# EAGLE design AudioTest (EAGLE 7.7.0)
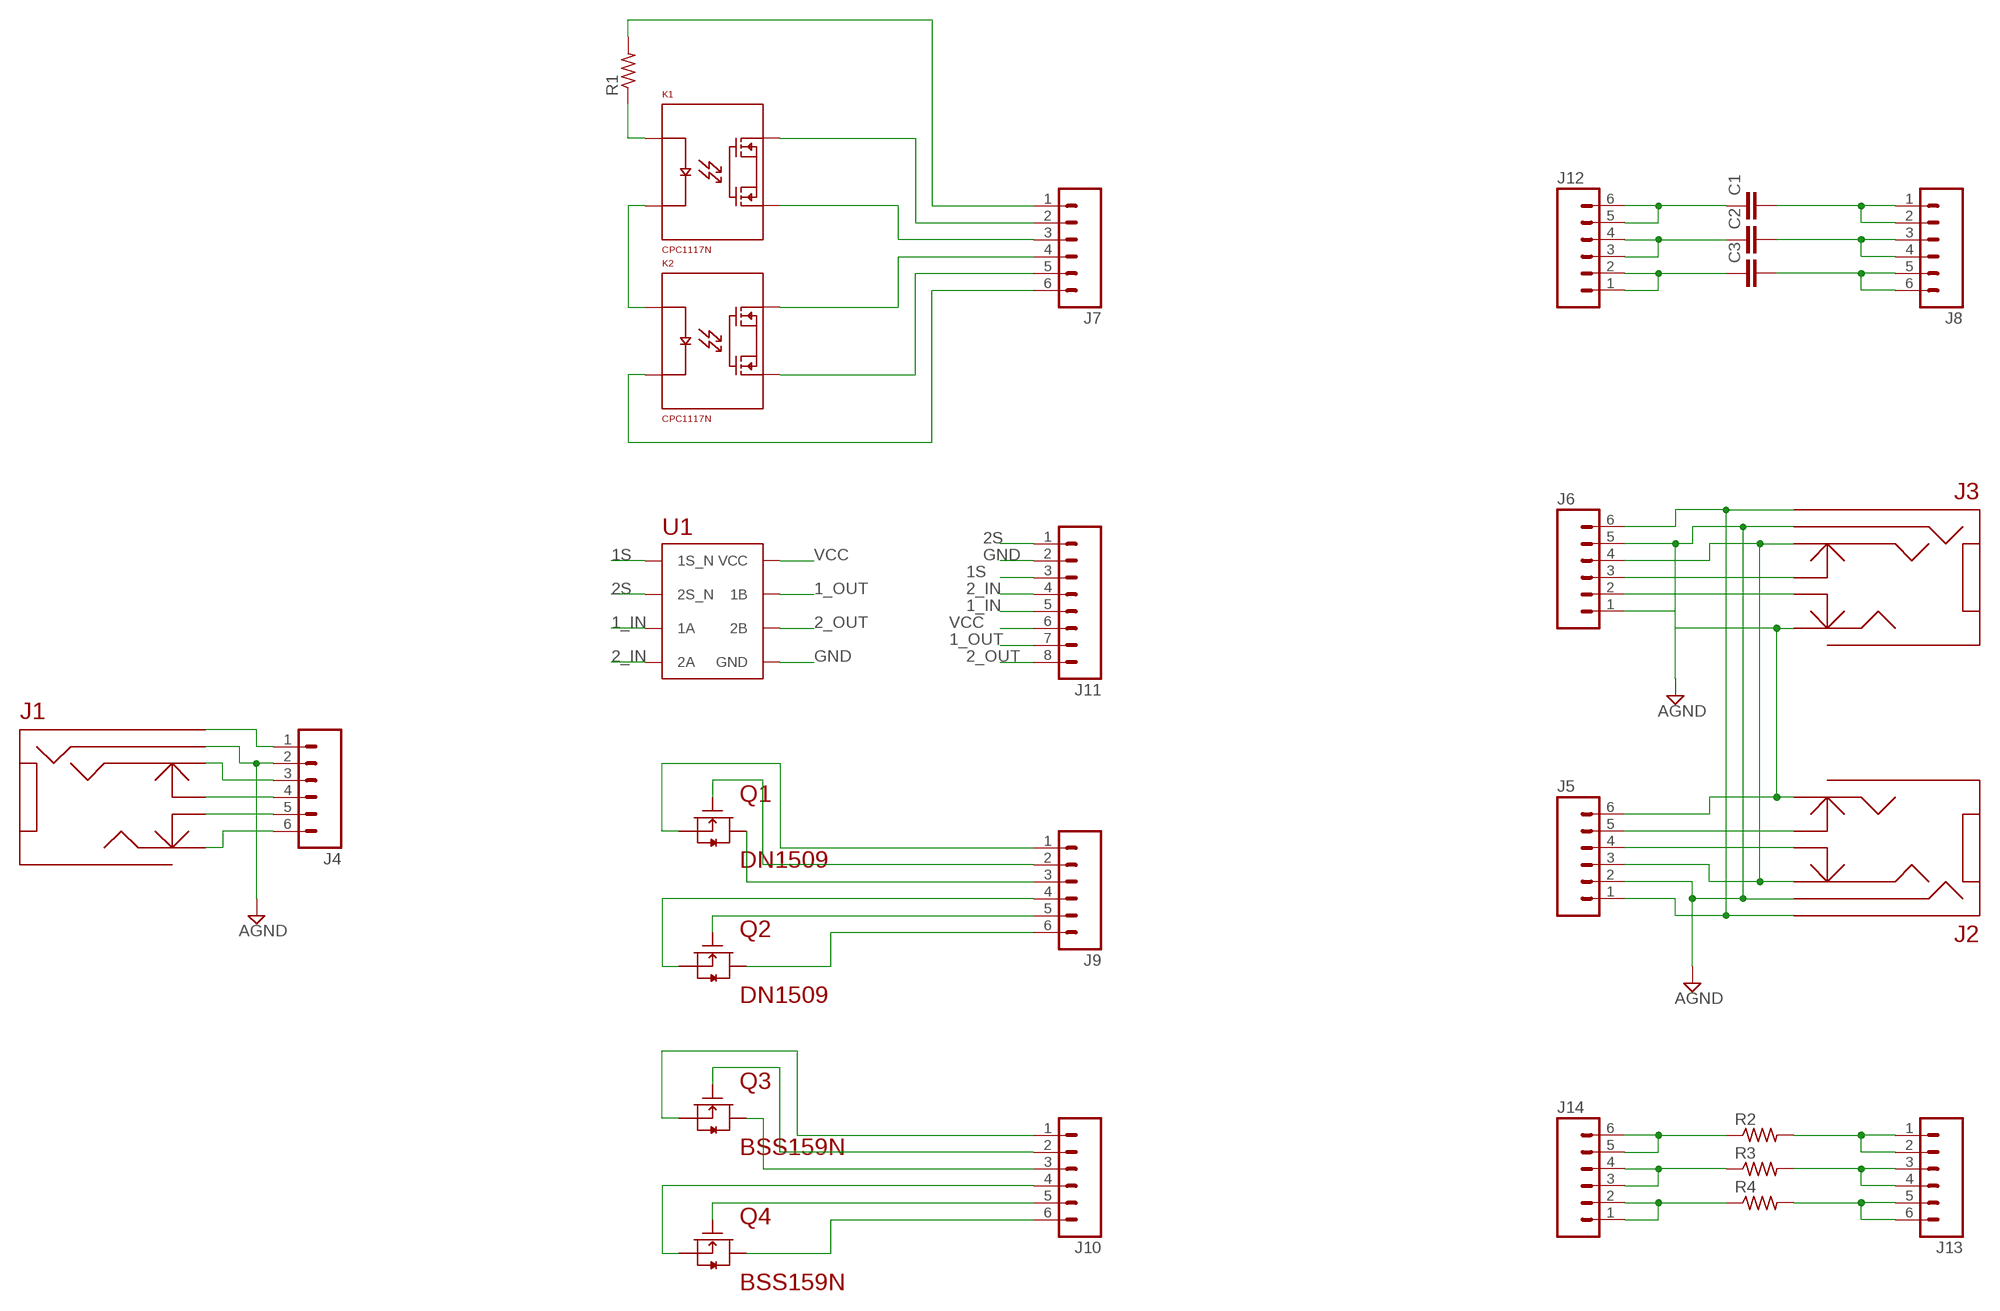
[diagram p0: schematic, sheet 1]

## Parts
C1  C-EUC1210  [C1210]
C2  C-EUC1210  [C1210]
C3  C-EUC1210  [C1210]
J1  SJ-43516  [SJ-43516-SMT]
J2  SJ-43516  [SJ-43516-SMT]
J3  SJ-43516  [SJ-43516-SMT]
J4  M06LOCK  [1X06_LOCK]
J5  M06LOCK  [1X06_LOCK]
J6  M06LOCK  [1X06_LOCK]
J7  M06LOCK  [1X06_LOCK]
J8  M06LOCK  [1X06_LOCK]
J9  M06LOCK  [1X06_LOCK]
J10  M06LOCK  [1X06_LOCK]
J11  M08LOCK  [1X08_LOCK]
J12  M06LOCK  [1X06_LOCK]
J13  M06LOCK  [1X06_LOCK]
J14  M06LOCK  [1X06_LOCK]
K1  CPC1117N  [4-SOP]
K2  CPC1117N  [4-SOP]
Q1  DN1509  [SOT-23-5]
Q2  DN1509  [SOT-23-5]
Q3  BSS159N  [SOT-23-3]
Q4  BSS159N  [SOT-23-3]
R1  R-US_R0805  [R0805]
R2  R-US_M0805  [M0805]
R3  R-US_M0805  [M0805]
R4  R-US_M0805  [M0805]
U1  FSA553  [9-UFBGA-NSMD]

## Nets
1_IN: J11.5 U1.A1(1A)
1_L: J1.2(LEFT) J4.6
1_L_SW: J1.5(LEFT_NC) J4.5
1_M: J1.1(MIC) J4.1
1_OUT: J11.7 U1.A3(1B)
1_R: J1.3(RIGHT) J4.3
1_R_SW: J1.6(RIGHT_NC) J4.4
1S: J11.3 U1.C1(1S_N)
2_IN: J11.4 U1.B1(2A)
2_L: J2.2(LEFT) J3.2(LEFT) J5.6 J6.1
2_L_SW: J2.5(LEFT_NC) J5.5
2_M: J2.1(MIC) J3.1(MIC) J5.1 J6.6
2_OUT: J11.8 U1.B3(2B)
2_R: J2.3(RIGHT) J3.3(RIGHT) J5.3 J6.4
2_R_SW: J2.6(RIGHT_NC) J5.4
2S: J11.1 U1.C3(2S_N)
3_SW_L: J3.5(LEFT_NC) J6.2
3_SW_R: J3.6(RIGHT_NC) J6.3
AGND: J1.4(GND) J2.4(GND) J3.4(GND) J4.2 J5.2 J6.5
D1: J9.3 Q1.2(D)
D2: J9.6 Q2.2(D)
D3: J10.3 Q3.3(D)
D4: J10.6 Q4.3(D)
G1: J9.2 Q1.5(G)
G2: J9.5 Q2.5(G)
G3: J10.2 Q3.1(G)
G4: J10.5 Q4.1(G)
GND: J11.2 U1.C2(GND)
N$3: C3.1 J12.1 J12.2
N$10: C3.2 J8.5 J8.6
N$15: K1.1(A) R1.1
N$16: K1.2(C) K2.1(A)
N$34: C2.2 J8.3 J8.4
N$35: C1.2 J8.1 J8.2
N$36: C1.1 J12.5 J12.6
N$37: C2.1 J12.3 J12.4
N$38: J14.1 J14.2 R4.1
N$39: J13.5 J13.6 R4.2
N$40: J13.3 J13.4 R3.2
N$41: J13.1 J13.2 R2.2
N$42: J14.5 J14.6 R2.1
N$43: J14.3 J14.4 R3.1
R_GND: J7.6 K2.2(C)
R_IN1: J7.2 K1.4(LOAD1)
R_IN2: J7.4 K2.4(LOAD1)
R_OUT1: J7.3 K1.3(LOAD2)
R_OUT2: J7.5 K2.3(LOAD2)
R_V+: J7.1 R1.2
S1: J9.1 Q1.4(S)
S2: J9.4 Q2.4(S)
S3: J10.1 Q3.2(S)
S4: J10.4 Q4.2(S)
VCC: J11.6 U1.A2(VCC)

## Library data of the parts
C1-C3 = resistor:C-EU: CAPACITOR, European symbol
J1-J3 = Master:SJ-43516: SJ-43516 - Female 3.5mm Audio Connector Datasheet: http://www.cui.com/product/resource/sj-4351x-smt-series.pdf
J4-J10 J12-J14 = SparkFun-Connectors:M06: Header 6 Standard 6-pin 0.1" header. Use with straight break away headers (SKU : PRT-00116), right angle break away headers (PRT-00553), swiss pins (PRT-00743), machine pins (PRT-00117), and female headers (PRT-00115). Molex polarized connector foot print use with SKU : PRT-08094 with associated crimp pins and housings. NOTES ON THE VARIANTS LOCK and LOCK_LONGPADS... This footprint was designed to help hold the alignment of a through-hole component (i.e. 6-pin header) while soldering it into place. You may notice that each hole has been shifted either up or down by 0.005 of an inch from it's more standard position (which is a perfectly straight line). This slight alteration caused the pins (the squares in the middle) to touch the edges of the holes. Because they are alternating, it causes a "brace" to hold the component in place. 0.005 has proven to be the perfect amount of "off-center" position when using our standard breakaway headers. Although looks a little odd when you look at the bare footprint, once you have a header in there, the alteration is very hard to notice. Also,if you push a header all the way into place, it is covered up entirely on the bottom side. This idea of altering the position of holes to aid alignment will be further integrated into the Sparkfun Library for other footprints. It can help hold any component with 3 or more connection pins.
J11 = SparkFun-Connectors:M08: Header 8 Standard 8-pin 0.1" header. Use with straight break away headers (SKU : PRT-00116), right angle break away headers (PRT-00553), swiss pins (PRT-00743), machine pins (PRT-00117), and female headers (PRT-00115).
K1 K2 = Master:CPC1117N: CPC1117N - 60V Normally-Closed Single-Pole Relay Company: IXYS - Integrated Circuits Division Datasheet: http://www.ixysic.com/home/pdfs.nsf/www/CPC1117N.pdf/$file/CPC1117N.pdf
Q1 Q2 = Master:DN1509: DN1509 - Microchip N-Channel, Depletion-Mode, DMOS FET Datasheet: http://ww1.microchip.com/downloads/en/DeviceDoc/20005403B.pdf
Q3 Q4 = Master:BSS159N: BSS159N - Infeon N-Channel, Depletion-Mode MOSFET Datasheet: http://www.infineon.com/dgdl/Infineon-BSS159N-DS-v02_02-en.pdf?fileId=db3a304330f68606013108d8b2230036
R1-R4 = resistor:R-US_: RESISTOR, American symbol
U1 = Master:FSA553: FSA553 - Depletion Mode Analog Switch Datasheet: https://www.fairchildsemi.com/datasheets/FS/FSA553.pdf

## Board
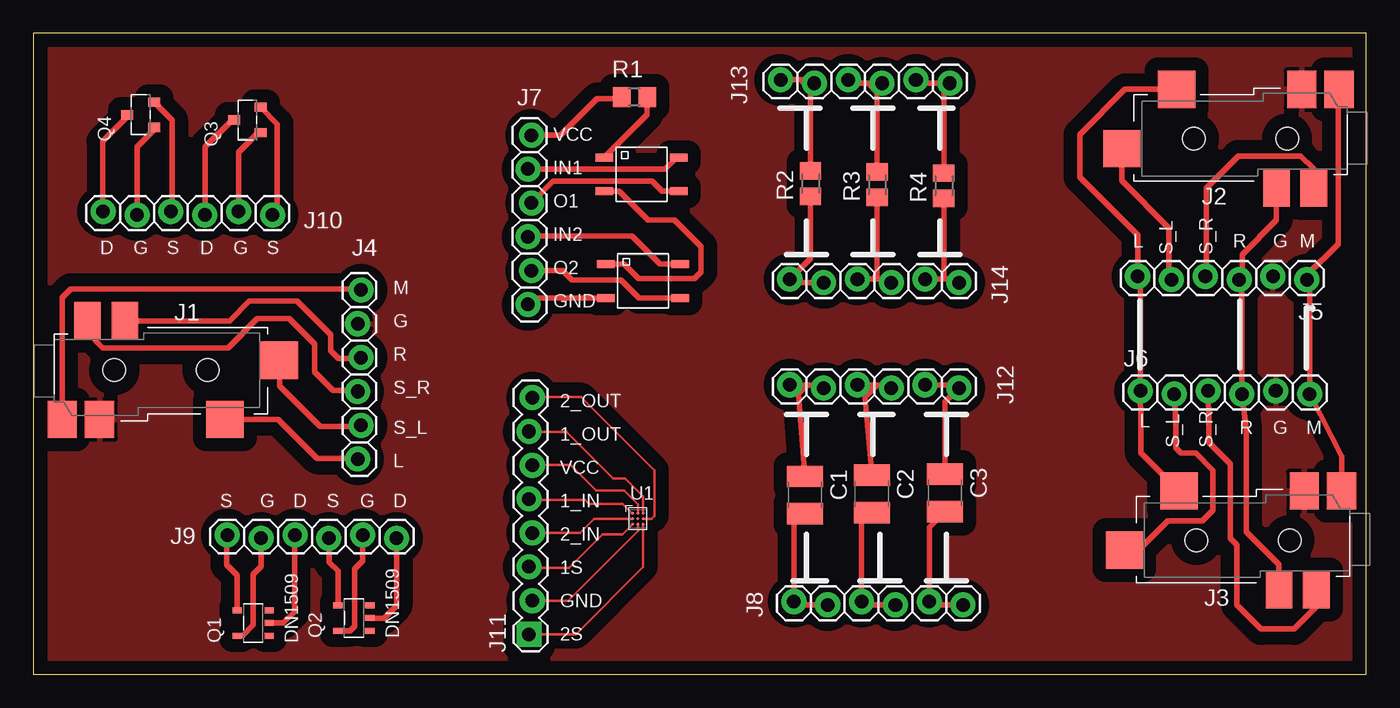
[diagram p1: board, top side]

Size 100 x 48.1 mm. Coordinates in mm from the lower left corner, seen from the top.
Outline: 0,0 100,0 100,48.1 0,48.1 0,0
Copper layers (1*16): Top 0.035mm / dielectric 1.5mm / Bottom 0.035mm
Design rules "default": minimum track width 10mil, minimum drill 24mil, track to track 8mil, track to pad 8mil, pad to pad 8mil, via to via 8mil, smd to smd 8mil, copper to edge 40mil, drill to drill 8mil, minimum pad ring 10mil, minimum via ring 8mil, stop-mask expansion 4mil, vias tented up to drill 0mil, thermal gap 10mil

### Footprints (pad centres in the part's own frame; a part is rotated, then mirrored left to right if it is on the bottom)
C1210 = smd 1.6 x 2.7: 1 -1.4,0; 2 1.4,0
SJ-43516-SMT = smd 2.2 x 2.8: 1 0.6,-1.4; 4 3.4,-1.4 | smd 2.8 x 2.8: 2 12.8,-1.4; 5 16.9,3.05 | smd 2 x 2.8: 3 5.3,6; 6 2.5,6 | hole 1.7: 4.5,2.3; 11.5,2.3
1X06_LOCK = drill 1.016 pad 1.88: 1 0,0; 2 2.54,-0.254; 3 5.08,0; 4 7.62,-0.254; 5 10.16,0; 6 12.7,-0.254
1X08_LOCK = drill 1.016 pad 1.88 square: 1 0,0.127 | drill 1.016 pad 1.88: 2 2.54,-0.127; 3 5.08,0.127; 4 7.62,-0.127; 5 10.16,0.127; 6 12.7,-0.127; 7 15.24,0.127; 8 17.78,-0.127
4-SOP = smd 1.3 x 0.6: 1 -2.8,1.27; 2 -2.8,-1.27; 3 2.8,-1.27; 4 2.8,1.27
SOT-23-5 = smd 0.45 x 0.7: 1 -0.95,-1.2; 2 0,-1.2; 3 0.95,-1.2; 4 0.95,1.2; 5 -0.95,1.2
SOT-23-3 = smd 0.7 x 0.9: 1 -0.95,-2; 2 0.95,-2; 3 0,0
R0805 = smd 1.3 x 1.5: 1 -0.95,0; 2 0.95,0
M0805 = smd 1.3 x 1.6: 1 -0.95,0; 2 0.95,0
9-UFBGA-NSMD = smd 0.21 x 0.21: A1 -0.4,0.4; A2 0,0.4; A3 0.4,0.4; B1 -0.4,0; B2 0,0; B3 0.4,0; C1 -0.4,-0.4; C2 0,-0.4; C3 0.4,-0.4

### Placement (x,y rotation side)
C1  57.9,13.45 270 top
C2  62.9,13.53 270 top
C3  68.4,13.61 270 top
J1  1.57,20.52 0 top
J2  98.57,42.49 180 top
J3  98.75,12.36 180 top
J4  24.59,28.84 270 top
J5  95.55,29.61 180 top
J6  83.06,21.27 0 top
J7  37.37,40.45 270 top
J8  57.06,5.45 0 top
J9  14.55,10.45 0 top
J10  17.94,34.47 180 top
J11  37.31,2.98 90 top
J12  69.45,21.47 180 top
J13  56.06,44.61 0 top
J14  69.45,29.39 180 top
K1  45.63,37.51 0 top
K2  45.74,29.51 0 top
Q1  16.49,3.85 90 top
Q2  24.06,4.22 90 top
Q3  15.06,41.6 90 top
Q4  7.06,41.98 90 top
R1  45.1,43.31 180 top
R2  58.31,36.82 90 top
R3  63.31,36.74 90 top
R4  68.31,36.66 90 top
U1  45.36,11.67 0 top

### Tracks (layer width: path | path; a pad name or v marks a point on that pad's centre or on a via)
1_IN
  Top 0.178: U1.A1 44.93,12.07 44.2,12.8 41.7,12.8 41.4,13.1 37.22,13.1 J11.5
1_L
  Top 0.406: J1.2 18.38,19.12 21.3,16.2 24.28,16.2 J4.6
1_L_SW
  Top 0.406: J1.5 18.47,21.63 21.5,18.6 24.51,18.6 J4.5
1_M
  Top 0.406: J1.1 2.17,28.27 2.8,28.9 24.53,28.9 J4.1
1_OUT
  Top 0.178: U1.A3 45.76,13.34 44.4,14.7 43.5,14.7 40,18.2 37.2,18.2 J11.7
1_R
  Top 0.406: J1.3 14.72,26.52 16.2,28 19.8,28 22.3,25.5 22.3,24.3 22.9,23.7 24.53,23.7 J4.3
1_R_SW
  Top 0.406: J1.6 4.07,25.63 5.2,24.5 14.6,24.5 16.8,26.7 19.2,26.7 21.1,24.8 21.1,22.7 22.5,21.3 24.26,21.3 J4.4
1S
  Top 0.178: U1.C1 44.2,10.5 42.7,10.5 40.2,8 37.24,8 J11.3
2_IN
  Top 0.178: U1.B1 42.07,11.67 41,10.6 J11.4
2_L
  Top 0.406: J3.2 83.1,16.6 83.1,18.93 J6.1 83.06,29.65 J5.6 82.85,32.95 78.5,37.3 78.5,40.5 81.9,43.9 J2.2
2_L_SW
  Top 0.406: J2.5 81.67,37.03 85.2,33.5 85.2,29.8 J5.5
2_M
  Top 0.406: J3.1 98.15,16.33 J6.6 95.76,29.4 J5.1 95.55,29.95 97.9,32.3 97.9,43.82 J2.1
2_OUT
  Top 0.178: U1.B3 46.37,11.67 46.6,11.9 46.6,15.3 41.1,20.8 37.48,20.8 J11.8
2_R
  Top 0.406: J3.3 93.45,8.25 91,10.7 91,18.4 J6.4 90.68,29.4 J5.3 90.7,29.84 90.7,31.5 93.27,34.07 J2.3
2_R_SW
  Top 0.406: J2.6 96.07,37.93 95.1,38.9 90.4,38.9 88,36.5 88,29.93 J5.4
2S
  Top 0.178: U1.C3 45.76,8.06 40.7,3 37.2,3 J11.1
3_SW_L
  Top 0.406: J3.5 82.91,9.31 85.1,11.5 87.7,11.5 88.5,12.3 88.5,15.3 87.2,16.6 86.1,16.6 85.7,17 85.7,18.62 J6.2
3_SW_R
  Top 0.406: J3.6 96.25,5.05 94.6,3.4 92.1,3.4 90.3,5.2 90.3,9.7 89.8,10.2 89.8,15.8 88.2,17.4 88.2,18.91 J6.3
AGND
  pour Top (isolate 1): 1,47 1,1 99,1 99,47
D1
  Top 0.406: Q1.2 18.75,3.85 19.6,4.7 19.6,10.42 J9.3
D2
  Top 0.406: J9.6 27.25,5.15 26.3,4.2 25.28,4.2 Q2.2
D3
  Top 0.406: Q3.3 14.9,41.6 12.9,39.6 12.9,34.51 J10.3
D4
  Top 0.406: Q4.3 7.06,41.86 5.2,40 5.2,34.76 J10.6
G1
  Top 0.406: Q1.5 15.7,2.9 16.5,3.7 16.5,7.5 17.1,8.1 17.1,10.19 J9.2
G2
  Top 0.406: Q2.5 23.77,3.27 24.1,3.6 24.1,7.9 24.7,8.5 J9.5
G3
  Top 0.406: Q3.1 16.85,40.65 15.4,39.2 J10.2
G4
  Top 0.406: Q4.1 9.06,40.86 7.8,39.6 7.8,34.49 J10.5
GND
  Top 0.178: U1.C2 45.36,10.76 40.1,5.5 37.46,5.5 J11.2
N$3
  Top 0.406: J12.2 69.2,21.72 J12.1 68.4,20.42 C3.1
N$10
  Top 0.406: J8.6 67.47,5.2 J8.5 67.22,11.03 C3.2
N$15
  Top 0.406: R1.1 46.05,42 K1.1
N$16
  Top 0.406: K1.2 43.96,36.24 46.1,34.1 48.1,34.1 50.1,32.1 50.1,30.2 49.6,29.7 45.4,29.7 44.3,30.8 42.96,30.8 K2.1
N$34
  Top 0.406: J8.4 62.39,5.2 J8.3 62.14,11.87 C2.2
N$35
  Top 0.406: J8.2 57.31,5.2 J8.1 57.06,11.71 C1.2
N$36
  Top 0.406: J12.6 58.1,21.72 | 58.1,21.72 59.04,21.72 J12.5 | C1.1 57.4,21.02 58.1,21.72
N$37
  Top 0.406: J12.4 63.3,21.72 | 63.3,21.72 64.12,21.72 J12.3 | C2.1 62.4,20.82 63.3,21.72
N$38
  Top 0.406: J14.2 68.3,29.64 | 68.3,29.64 69.2,29.64 J14.1 | R4.1 68.31,29.65 68.3,29.64
N$39
  Top 0.406: J13.6 68,44.36 | 68,44.36 66.47,44.36 J13.5 | R4.2 68.31,44.05 68,44.36
N$40
  Top 0.406: J13.4 62.6,44.36 | 62.6,44.36 61.39,44.36 J13.3 | R3.2 63.31,43.65 62.6,44.36
N$41
  Top 0.406: J13.1 57.6,44.61 | 57.6,44.61 58.35,44.61 J13.2 | R2.2 58.31,43.9 57.6,44.61
N$42
  Top 0.406: R2.1 58.31,31.2 J14.6 57,29.39 J14.5
N$43
  Top 0.406: J14.4 63,29.64 | 63,29.64 64.12,29.64 J14.3 | R3.1 63.31,29.95 63,29.64
R_GND
  Top 0.406: K2.2 37.61,28.24 J7.6
R_IN1
  Top 0.406: K1.4 48.28,38.78 47.4,37.9 J7.2
R_IN2
  Top 0.406: K2.4 47.02,30.78 44.9,32.9 37.19,32.9 J7.4
R_OUT1
  Top 0.406: K1.3 47.16,36.24 46.4,37 39,37 J7.3
R_OUT2
  Top 0.406: K2.3 45.46,28.24 44.1,29.6 40.4,29.6 39.7,30.3 J7.5
R_V+
  Top 0.406: J7.1 39.55,40.45 42.3,43.2 44.04,43.2 R1.2
S1
  Top 0.406: Q1.4 15.29,7.41 14.5,8.2 14.5,10.4 J9.1
S2
  Top 0.406: Q2.4 22.86,7.74 22.2,8.4 22.2,10.17 J9.4
S3
  Top 0.406: Q3.2 18.3,41.3 18.3,34.83 J10.1
S4
  Top 0.406: Q4.2 10.4,41.6 10.4,34.8 J10.4
VCC
  Top 0.178: U1.A2 45.36,12.74 44.3,13.8 42.2,13.8 40.3,15.7 37.46,15.7 J11.6

### Text on the board
tPlace: VCC | IN1 | O1 | D | G | S | D | G | S | IN2 | L | S_L | S_R | R | G | M | O2 | M | GND | G | R | S_R | 2_OUT | S_L | 1_OUT | L | R | G | M | S_L | S_R | L | VCC | S | G | D | S | G | D | 1_IN | 2_IN | 1S | GND | 2S